# Altium schematic sheet 3_BLE-T1-mcu.SchDoc
size A4
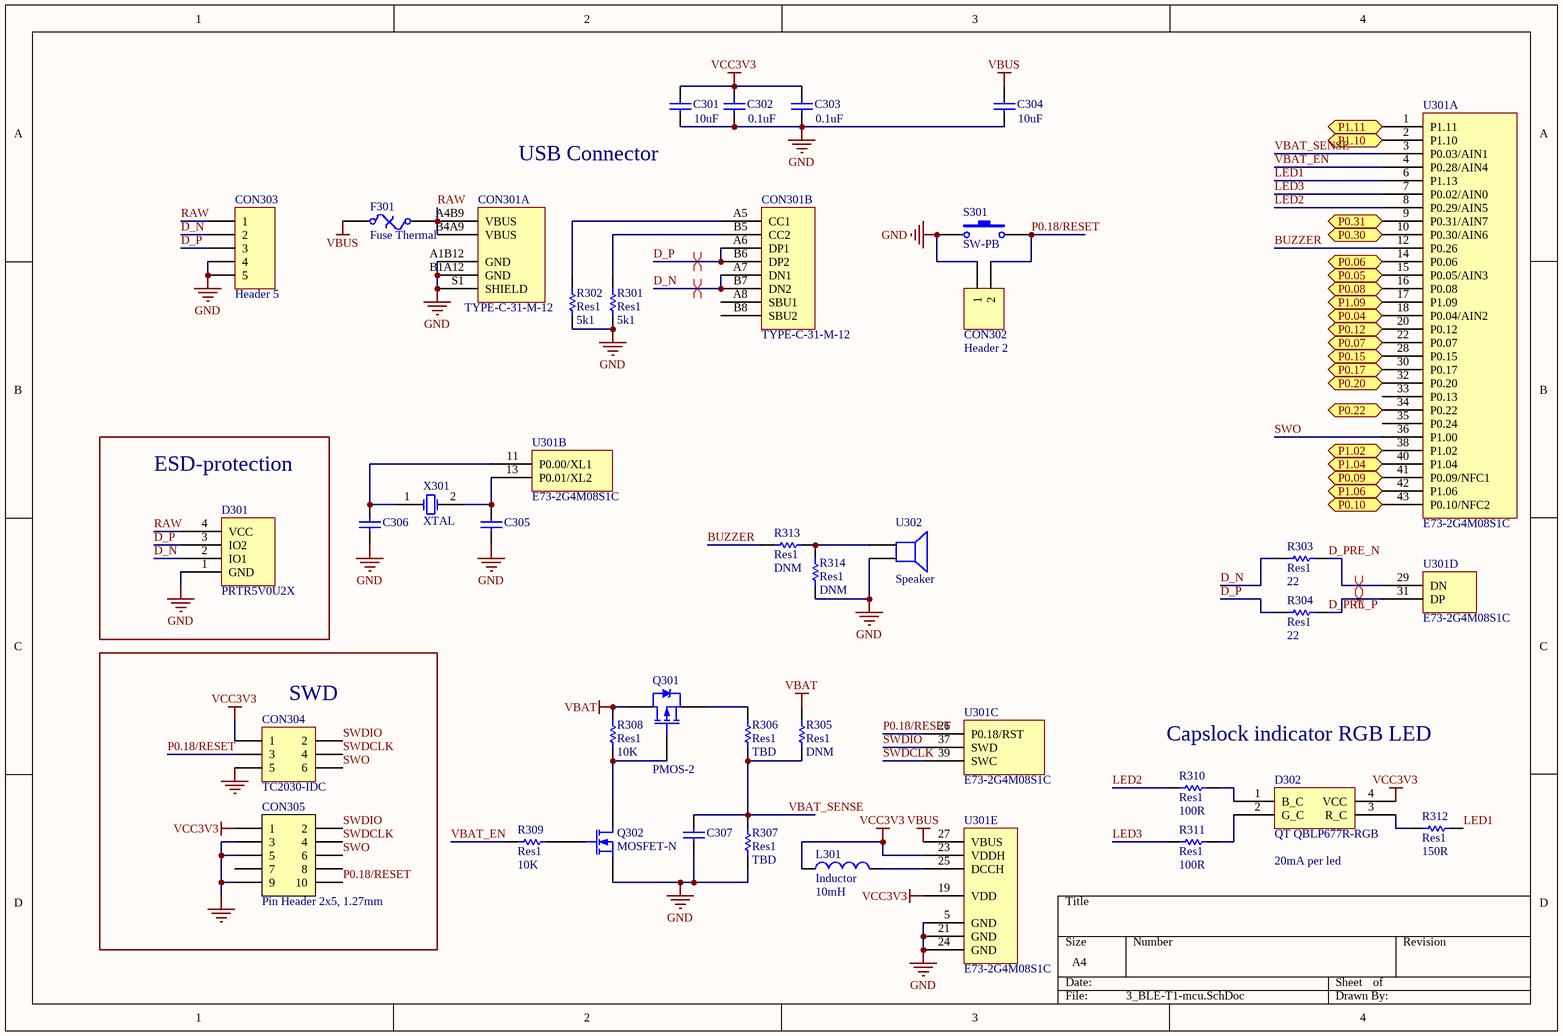
[diagram p0: 3_BLE-T1-mcu.SchDoc]

## Parts
C301  value 10uF  [C1206[3216]]
C302  value 0.1uF  [C0603[1608]]
C303  value 0.1uF  [C0603[1608]]
C304  value 10uF  [C1206[3216]]
C305  (no value)  [C0603[1608]]
C306  (no value)  [C0603[1608]]
C307  (no value)  [C0603[1608]]
CON301  TYPE-C-31-M-12  [TYPE-C-31-M-12]  (parts A,B of 2)
CON302  Header 2  [HDR1X2]  (no BOM)
CON303  Header 5  [JST SM04B-SRSS-TB]
CON304  TC2030-IDC  [TC2030-IDC-NL]  (no BOM)
CON305  Pin Header 2x5, 1.27mm  [HDR_2x5-SMD-1.27mm-K]
D301  PRTR5V0U2X  [SOT190P237X120-4N]
D302  QT QBLP677R-RGB  [QT QBLP677R-RGB]
F301  Fuse Thermal  [C1206[3216]]
L301  Inductor  value 10mH  [C0603[1608]]
Q301  PMOS-2  [SOT-23-3]
Q302  MOSFET-N  [SOT-23-3]
R301  Res1  value 5k1  [R0603[1608]]
R302  Res1  value 5k1  [R0603[1608]]
R303  Res1  value 22  [R0603[1608]]
R304  Res1  value 22  [R0603[1608]]
R305  Res1  value DNM  [R0603[1608]]
R306  Res1  value TBD  [R0603[1608]]
R307  Res1  value TBD  [R0603[1608]]
R308  Res1  value 10K  [R0603[1608]]
R309  Res1  value 10K  [R0603[1608]]
R310  Res1  value 100R  [R0603[1608]]
R311  Res1  value 100R  [R0603[1608]]
R312  Res1  value 150R  [R0603[1608]]
R313  Res1  value DNM  [R0603[1608]]
R314  Res1  value DNM  [R0603[1608]]
S301  SW-PB  [Combo switch]
U301  E73-2G4M08S1C  [E73-2G4M08S1C BLE-T1]  (parts A,B,C,D,E of 5)
U302  Speaker  [buzzer 12x12]
X301  XTAL  [Seiko Epson Q13FC1350000400]

## Blocks framed on the sheet
ESD-protection: D301
SWD: CON304 CON305

## Ports
P0.04, P0.05, P0.06, P0.07, P0.08, P0.09, P0.10, P0.12, P0.15, P0.17, P0.20, P0.22, P0.30, P0.31, P1.02, P1.04, P1.06, P1.09, P1.10, P1.11

## Nets
GND: C301.1 C302.1 C303.1 C304.1 C305.1 C306.1 C307.1 CON301.A1B12(GND) CON301.B1A12(GND) CON301.S1(SHIELD) CON302.1 CON303.4 CON303.5 CON304.5 CON305.3 CON305.5 CON305.9 D301.1(GND) Q302.2(S) R301.2 R302.2 R307.1 R314.1 S301.1 U301.5(GND) U301.21(GND) U301.24(GND) U302.2
VBAT: Q301.3(D) R305.2 R308.2
VBUS: C304.2 F301.1 U301.27(VBUS)
VCC3V3: C301.2 C302.2 C303.2 CON304.1 CON305.1 D302.4(VCC) L301.1 U301.19(VDD) U301.23(VDDH)
BUZZER: R313.1 U301.12(P0.26)
D_N: CON301.A7(DN1) CON301.B7(DN2) CON303.2 D301.2(IO1) R303.2
D_P: CON301.A6(DP1) CON301.B6(DP2) CON303.3 D301.3(IO2) R304.2
D_PRE_N: R303.1 U301.29(DN)
D_PRE_P: R304.1 U301.31(DP)
LED1: R312.1 U301.6(P1.13)
LED2: R310.2 U301.8(P0.29/AIN5)
LED3: R311.2 U301.7(P0.02/AIN0)
P0.04: U301.18(P0.04/AIN2) ; port P0.04
P0.05: U301.15(P0.05/AIN3) ; port P0.05
P0.06: U301.14(P0.06) ; port P0.06
P0.07: U301.22(P0.07) ; port P0.07
P0.08: U301.16(P0.08) ; port P0.08
P0.09: U301.41(P0.09/NFC1) ; port P0.09
P0.10: U301.43(P0.10/NFC2) ; port P0.10
P0.12: U301.20(P0.12) ; port P0.12
P0.15: U301.28(P0.15) ; port P0.15
P0.17: U301.30(P0.17) ; port P0.17
P0.18/RESET: CON302.2 CON304.3 CON305.10 S301.2 U301.26(P0.18/RST)
P0.20: U301.32(P0.20) ; port P0.20
P0.22: U301.34(P0.22) ; port P0.22
P0.30: U301.10(P0.30/AIN6) ; port P0.30
P0.31: U301.9(P0.31/AIN7) ; port P0.31
P1.02: U301.38(P1.02) ; port P1.02
P1.04: U301.40(P1.04) ; port P1.04
P1.06: U301.42(P1.06) ; port P1.06
P1.09: U301.17(P1.09) ; port P1.09
P1.10: U301.2(P1.10) ; port P1.10
P1.11: U301.1(P1.11) ; port P1.11
RAW: CON301.A4B9(VBUS) CON301.B4A9(VBUS) CON303.1 D301.4(VCC) F301.2
SWDCLK: CON304.4 CON305.4 U301.39(SWC)
SWDIO: CON304.2 CON305.2 U301.37(SWD)
SWO: CON304.6 CON305.6 U301.36(P1.00)
VBAT_EN: R309.2 U301.4(P0.28/AIN4)
VBAT_SENSE: C307.2 R305.1 R306.1 R307.2 U301.3(P0.03/AIN1)
NetC305_2: C305.2 U301.13(P0.01/XL2) X301.2(OSC2)
NetC306_2: C306.2 U301.11(P0.00/XL1) X301.1(OSC1)
NetCON301_A5: CON301.A5(CC1) R302.1
NetCON301_B5: CON301.B5(CC2) R301.1
NetD302_1: D302.1(B_C) R310.1
NetD302_2: D302.2(G_C) R311.1
NetD302_3: D302.3(R_C) R312.2
NetL301_2: L301.2 U301.25(DCCH)
NetQ301_1: Q301.1(G) Q302.3(D) R308.1
NetQ301_2: Q301.2(S) R306.2
NetQ302_1: Q302.1(G) R309.1
NetR313_2: R313.2 R314.2 U302.1

Not connected (* = marked no-connect by the designer): CON301 A8(SBU1) B8(SBU2); CON305 7 8; U301 33(P0.13) 35(P0.24)

## Layout directives
differential pair: D_N, D_P, D_PRE_N, D_PRE_P

## Notes on the sheet
- (near C301) USB Connector
- Capslock indicator RGB LED
- (near D302) 20mA per led

## Library data of the parts
C301 C304 = Cap: Capacitor; MRF.Part: C3216X7R1C106KT000N; MFG: KEMET; MFGPN: C1206C106M3PACTU; LCSC MFG: TDK; Version: 1206 imperial; LCSCPN: C342827
C302 C303 = Cap: Capacitor; MRF.Part: CC0603KRX7R9BB104; MFG: KEMET; MFGPN: C0603C104M5RACTU; LCSC MFG: YAGEO; Version: 0603 imperial; LCSCPN: C14663
C305-C307 = Cap: Capacitor; Version: 0603 imperial
CON301 = TYPE-C-31-M-12: MFG: Korean Hroparts Elec; MFGPN: TYPE-C-31-M-12; LCSC Part #: C165948; LCSC MFG: Korean Hroparts Elec; MRF.Part: TYPE-C-31-M-12
CON302 = Header 2: Header, 2-Pin; LatestRevisionDate: 17-Jul-2002; LatestRevisionNote: Re-released for DXP Platform.; Publisher: Altium Limited
CON303 = Header 5: JST for USB daughter board; MFGPN: SM04B-SRSS-TB(LF)(SN); MFG: JST Sales America Inc.; LCSC MFG: JST Sales America; LCSC Part #: C160404; MRF.Part: SM04B-SRSS-TB(LF)(SN)
CON304 = Header 3X2: Header, 3-Pin, Dual row
CON305 = Pin Header 2x5 SMD, 1.27mm, KS: Pin Header 2x5, 1.27mm (50mil), SMD, Keying Shroud; MFG: Samtec Inc.; MFGPN: FTSH-105-01-F-DV-K-TR; Value: Pin Header 2x5, 1.27mm
D301 = PRTR5V0U2X: MRF.Part: UET14A05L03; MFG: Nexperia USA Inc.; MFGPN: PRTR5V0U2X,215; LCSC MFG: Brightking Elec (TAIWAN); LCSC Part #: C78442
D302 = QT QBLP677R-RGB: RGB LED; MFG: QT Brightek (QTB); MFGPN: QBLP677R-RGB; Version: Common Anode RGB LED
F301 = Fuse Thermal: Thermal Fuse; MRF.Part: ASMD1206-050; MFG: Bel Fuse Inc.; MFGPN: 0ZCJ0050FF2G; LCSC MFG: Shenzhen JDT Fuse; LCSC Part #: C135338
L301 = Inductor: Code_IEC: 1005; Published: 8-Jun-2000; LatestRevisionDate: 29-May-2009; LatestRevisionNote: IPC-7351 Footprint Added.; PackageReference: 0402-A; Publisher: Altium Limited; PackageDescription: Chip Inductor; Code_JEITA: 0402
Q301 = PMOS-2: P-Channel Power MOSFET; Note: Pin 4 not drawn and electrically connected to Pin 2.; MFGPN: BSS84-7-F; Published: 8-Jun-2000; LatestRevisionDate: 17-Jul-2002; LatestRevisionNote: Re-released for DXP Platform.; DatasheetVersion: PD-9.390D; PackageVersion: Feb-1997; PackageReference: TO-220AB; Publisher: Altium Limited; PackageDescription: TO, Thru-Hole, Vertical, Heatsink Mounted; 3 In-Line Leads; Pitch 2.54 mm; ComponentLink1Description: Manufacturer Link; ComponentLink1URL: http://www.irf.com/; LCSCPN: C427395
Q302 = MOSFET-N: N-Channel MOSFET; MFGPN: 2N7002-7-F; LSCSPN: C501655; Published: 8-Jun-2000; LatestRevisionDate: 17-Jul-2002; LatestRevisionNote: Re-released for DXP Platform.; PackageVersion: 1995/1996; PackageReference: E3; Publisher: Altium Limited; PackageDescription: TO, Flat Index; 3 In-Line, Axial Leads; Body Dia. 4.6mm; Lead Dia. 0.5 mm (max)
R301 R302 = Res1: Resistor; MRF.Part: 0603WAF5101T5E; MFG: Panasonic Electronic Components; MFGPN: ERJ-3EKF5101V; LCSC MFG: Uniroyal Elec; Version: 0603 imperial; LCSC Part #: C23186
R303 R304 R313 R314 = Res1: Resistor; MRF.Part: 0603WAF220JT5E; MFG: Panasonic Electronic Components; MFGPN: ERJ-3EKF5101V; LCSC MFG: Uniroyal Elec; Version: 0603 imperial; LCSC Part #: C23345
R305-R309 R312 = Res1: Resistor; MFG: TE Connectivity Passive Product; MFGPN: CRGCQ0603F150R; Version: 0603 imperial
R310 R311 = Res1: Resistor; MFG: TE Connectivity Passive Product; MFGPN: CRG0603J100R; Version: 0603 imperial
S301 = SW-PB: Switch; MRF.Part: TS-1187A-C-D-B; MFGPN: PTS645SM43SMTR92 LFS; MFG: C&K; LCSC MFG: XKB Enterprise; LCSCPN: C318888
U302 = Speaker: Loudspeaker; Published: 24-Mar-1999; LatestRevisionDate: 17-Jul-2002; LatestRevisionNote: Re-released for DXP Platform.; PackageReference: PIN2; Publisher: Altium Limited
X301 = XTAL: Crystal Oscillator; MRF.Part: Q13FC1350000400; LCSC MFG: Seiko Epson; LCSC Part #: C32346